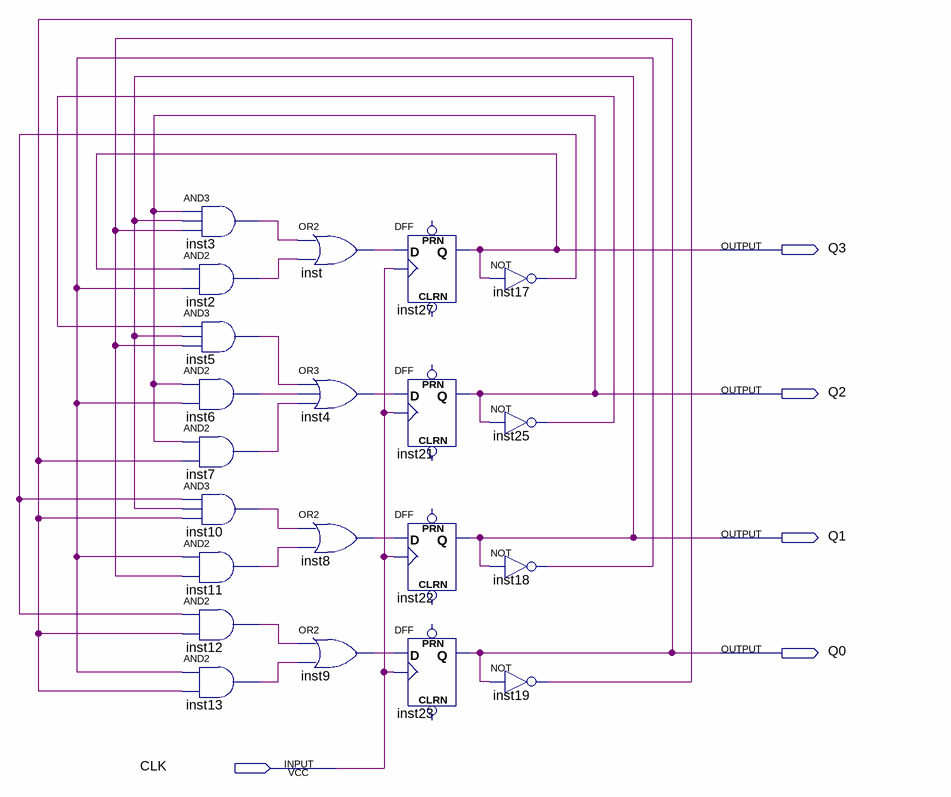
[diagram p0: schematic sheet]
// Quartus schematic Next_State_Expression_Design.bdf as structural Verilog: 21 symbols, 5 pins
module Next_State_Expression_Design (
  input  CLK,
  output Q3,
  output Q2,
  output Q1,
  output Q0
);

  wire inst2_out, inst3_out, inst4_out, inst5_out, inst6_out, inst7_out, inst8_out, inst9_out, inst10_out,
       inst11_out, inst12_out, inst13_out, inst17_out, inst18_out, inst19_out, inst25_out, inst_out;

  and inst3 (inst3_out, Q2, Q1, Q0);
  and inst2 (inst2_out, Q3, inst18_out);
  and inst5 (inst5_out, inst25_out, Q1, Q0);
  and inst6 (inst6_out, Q2, inst18_out);
  and inst7 (inst7_out, Q2, inst19_out);
  and inst10 (inst10_out, inst17_out, Q1, inst19_out);
  and inst11 (inst11_out, inst18_out, Q0);
  and inst12 (inst12_out, inst17_out, inst19_out);
  and inst13 (inst13_out, inst18_out, inst19_out);
  or inst (inst_out, inst3_out, inst2_out);
  or inst4 (inst4_out, inst5_out, inst6_out, inst7_out);
  or inst8 (inst8_out, inst10_out, inst11_out);
  or inst9 (inst9_out, inst12_out, inst13_out);
  DFF inst27 (.CLK(CLK), .D(inst_out), .Q(Q3));  // open: CLRN, PRN
  DFF inst21 (.CLK(CLK), .D(inst4_out), .Q(Q2));  // open: CLRN, PRN
  DFF inst22 (.CLK(CLK), .D(inst8_out), .Q(Q1));  // open: CLRN, PRN
  DFF inst23 (.CLK(CLK), .D(inst9_out), .Q(Q0));  // open: CLRN, PRN
  not inst17 (inst17_out, Q3);
  not inst25 (inst25_out, Q2);
  not inst18 (inst18_out, Q1);
  not inst19 (inst19_out, Q0);
endmodule
